# EAGLE board LEDS (EAGLE 8.0.1), part 1 of 2
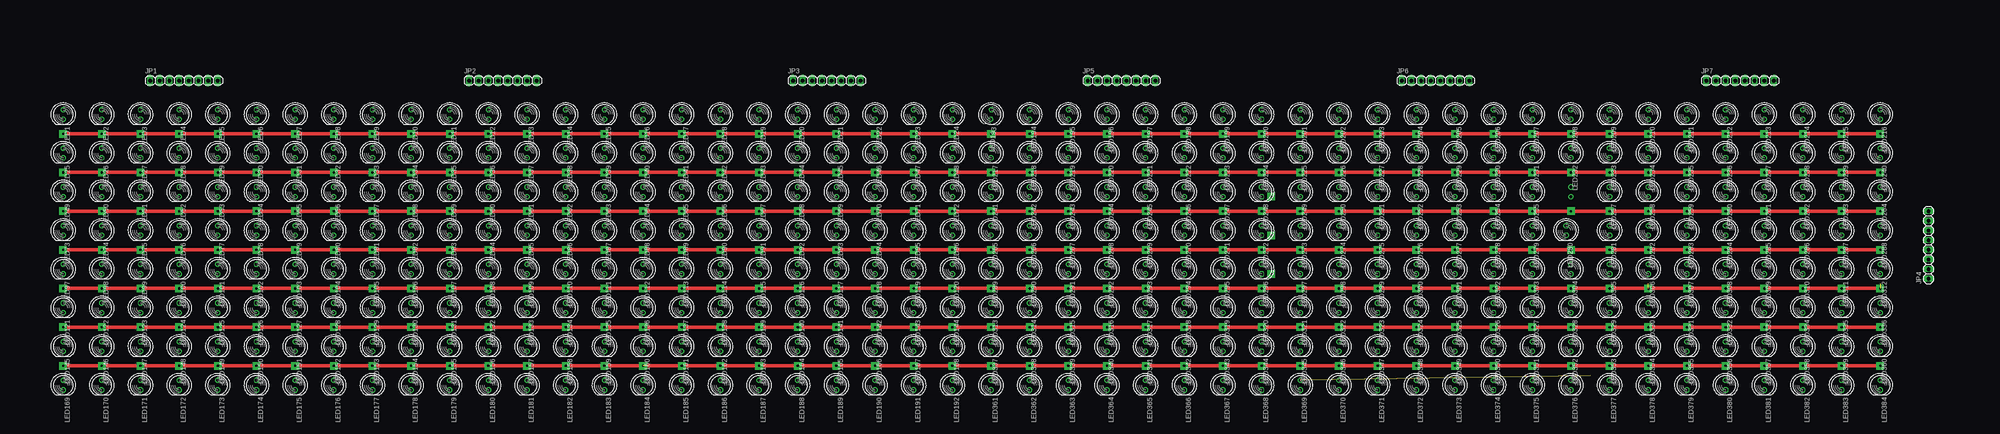
[diagram p1: board, top side]
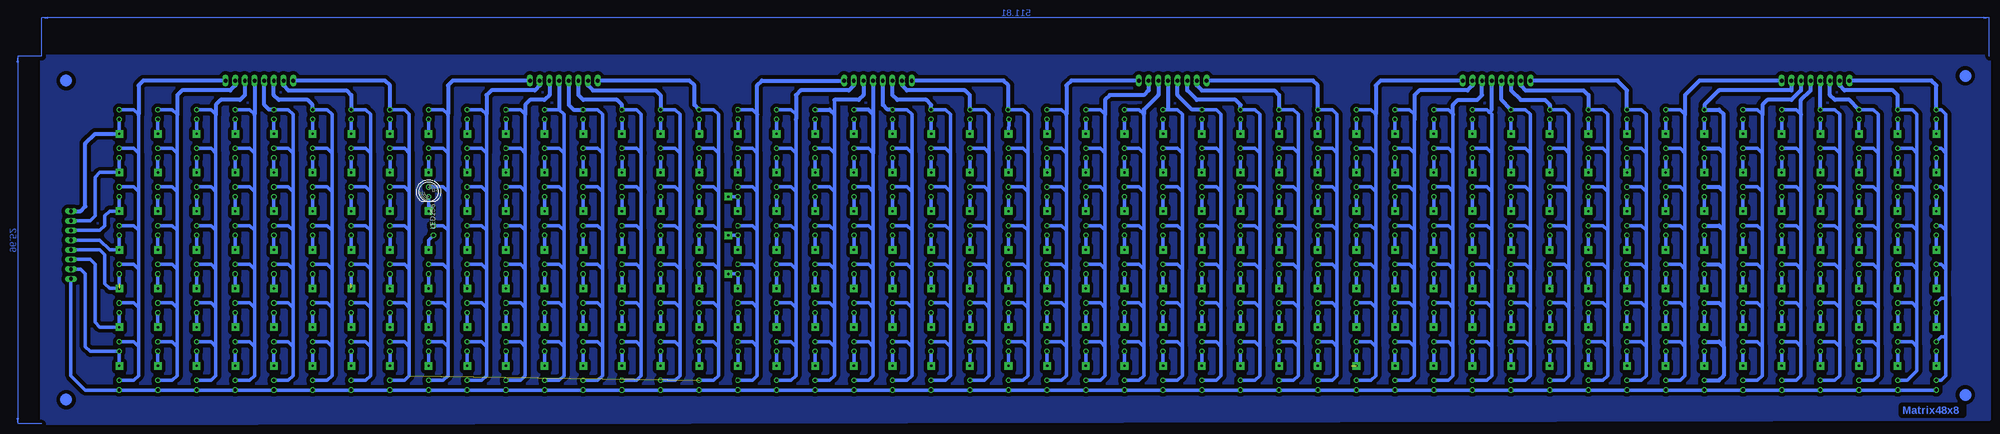
[diagram p2: board, bottom side, seen from below]

No outline drawn. Coordinates in mm, seen from the top.
Copper layers (1*16): Top 0.035mm / dielectric 1.5mm / Bottom 0.035mm
Design rules "default *": minimum track width 10mil, minimum drill 24mil, track to track 8mil, track to pad 8mil, pad to pad 8mil, via to via 8mil, smd to smd 8mil, copper to edge 40mil, drill to drill 8mil, minimum pad ring 10mil, minimum via ring 8mil, stop-mask expansion 4mil, vias tented up to drill 0mil, thermal gap 10mil

## Footprints (pad centres in the part's own frame; a part is rotated, then mirrored left to right if it is on the bottom)
1X08 = drill 1.016 long: 1 -8.89,0; 2 -6.35,0; 3 -3.81,0; 4 -1.27,0; 5 1.27,0; 6 3.81,0; 7 6.35,0; 8 8.89,0
LED5MM = drill 0.813 octagon: A -1.27,0; K 1.27,0

## Placement (x,y rotation side)
JP1  [1X08]  45.72,72.39 0 top
JP2  [1X08]  129.54,72.39 0 top
JP3  [1X08]  214.63,72.39 0 top
JP4  [1X08]  504.19,29.21 90 top
JP5  [1X08]  292.1,72.39 0 top
JP6  [1X08]  374.65,72.39 0 top
JP7  [1X08]  454.66,72.39 0 top
LED1  [LED5MM]  13.97,63.5 270 top
LED2  [LED5MM]  24.13,63.5 270 top
LED3  [LED5MM]  34.29,63.5 270 top
LED4  [LED5MM]  44.45,63.5 270 top
LED5  [LED5MM]  54.61,63.5 270 top
LED6  [LED5MM]  64.77,63.5 270 top
LED7  [LED5MM]  74.93,63.5 270 top
LED8  [LED5MM]  85.09,63.5 270 top
LED9  [LED5MM]  95.25,63.5 270 top
LED10  [LED5MM]  105.41,63.5 270 top
LED11  [LED5MM]  115.57,63.5 270 top
LED12  [LED5MM]  125.73,63.5 270 top
LED13  [LED5MM]  135.89,63.5 270 top
LED14  [LED5MM]  146.05,63.5 270 top
LED15  [LED5MM]  156.21,63.5 270 top
LED16  [LED5MM]  166.37,63.5 270 top
LED17  [LED5MM]  176.53,63.5 270 top
LED18  [LED5MM]  186.69,63.5 270 top
LED19  [LED5MM]  196.85,63.5 270 top
LED20  [LED5MM]  207.01,63.5 270 top
LED21  [LED5MM]  217.17,63.5 270 top
LED22  [LED5MM]  227.33,63.5 270 top
LED23  [LED5MM]  237.49,63.5 270 top
LED24  [LED5MM]  247.65,63.5 270 top
LED25  [LED5MM]  13.97,53.34 270 top
LED26  [LED5MM]  24.13,53.34 270 top
LED27  [LED5MM]  34.29,53.34 270 top
LED28  [LED5MM]  44.45,53.34 270 top
LED29  [LED5MM]  54.61,53.34 270 top
LED30  [LED5MM]  64.77,53.34 270 top
LED31  [LED5MM]  74.93,53.34 270 top
LED32  [LED5MM]  85.09,53.34 270 top
LED33  [LED5MM]  95.25,53.34 270 top
LED34  [LED5MM]  105.41,53.34 270 top
LED35  [LED5MM]  115.57,53.34 270 top
LED36  [LED5MM]  125.73,53.34 270 top
LED37  [LED5MM]  135.89,53.34 270 top
LED38  [LED5MM]  146.05,53.34 270 top
LED39  [LED5MM]  156.21,53.34 270 top
LED40  [LED5MM]  166.37,53.34 270 top
LED41  [LED5MM]  176.53,53.34 270 top
LED42  [LED5MM]  186.69,53.34 270 top
LED43  [LED5MM]  196.85,53.34 270 top
LED44  [LED5MM]  207.01,53.34 270 top
LED45  [LED5MM]  217.17,53.34 270 top
LED46  [LED5MM]  227.33,53.34 270 top
LED47  [LED5MM]  237.49,53.34 270 top
LED48  [LED5MM]  247.65,53.34 270 top
LED49  [LED5MM]  13.97,43.18 270 top
LED50  [LED5MM]  24.13,43.18 270 top
LED51  [LED5MM]  34.29,43.18 270 top
LED52  [LED5MM]  44.45,43.18 270 top
LED53  [LED5MM]  54.61,43.18 270 top
LED54  [LED5MM]  64.77,43.18 270 top
LED55  [LED5MM]  74.93,43.18 270 top
LED56  [LED5MM]  85.09,43.18 270 top
LED57  [LED5MM]  95.25,43.18 270 top
LED58  [LED5MM]  105.41,43.18 270 top
LED59  [LED5MM]  115.57,43.18 270 top
LED60  [LED5MM]  125.73,43.18 270 top
LED61  [LED5MM]  135.89,43.18 270 top
LED62  [LED5MM]  146.05,43.18 270 top
LED63  [LED5MM]  156.21,43.18 270 top
LED64  [LED5MM]  166.37,43.18 270 top
LED65  [LED5MM]  176.53,43.18 270 top
LED66  [LED5MM]  186.69,43.18 270 top
LED67  [LED5MM]  196.85,43.18 270 top
LED68  [LED5MM]  207.01,43.18 270 top
LED69  [LED5MM]  217.17,43.18 270 top
LED70  [LED5MM]  227.33,43.18 270 top
LED71  [LED5MM]  237.49,43.18 270 top
LED72  [LED5MM]  247.65,43.18 270 top
LED73  [LED5MM]  13.97,33.02 270 top
LED74  [LED5MM]  24.13,33.02 270 top
LED75  [LED5MM]  34.29,33.02 270 top
LED76  [LED5MM]  44.45,33.02 270 top
LED77  [LED5MM]  54.61,33.02 270 top
LED78  [LED5MM]  64.77,33.02 270 top
LED79  [LED5MM]  74.93,33.02 270 top
LED80  [LED5MM]  85.09,33.02 270 top
LED81  [LED5MM]  95.25,33.02 270 top
LED82  [LED5MM]  105.41,33.02 270 top
LED83  [LED5MM]  115.57,33.02 270 top
LED84  [LED5MM]  125.73,33.02 270 top
LED85  [LED5MM]  135.89,33.02 270 top
LED86  [LED5MM]  146.05,33.02 270 top
LED87  [LED5MM]  156.21,33.02 270 top
LED88  [LED5MM]  166.37,33.02 270 top
LED89  [LED5MM]  176.53,33.02 270 top
LED90  [LED5MM]  186.69,33.02 270 top
LED91  [LED5MM]  196.85,33.02 270 top
LED92  [LED5MM]  207.01,33.02 270 top
LED93  [LED5MM]  217.17,33.02 270 top
LED94  [LED5MM]  227.33,33.02 270 top
LED95  [LED5MM]  237.49,33.02 270 top
LED96  [LED5MM]  247.65,33.02 270 top
LED97  [LED5MM]  13.97,22.86 270 top
LED98  [LED5MM]  24.13,22.86 270 top
LED99  [LED5MM]  34.29,22.86 270 top
LED100  [LED5MM]  44.45,22.86 270 top
LED101  [LED5MM]  54.61,22.86 270 top
LED102  [LED5MM]  64.77,22.86 270 top
LED103  [LED5MM]  74.93,22.86 270 top
LED104  [LED5MM]  85.09,22.86 270 top
LED105  [LED5MM]  95.25,22.86 270 top
LED106  [LED5MM]  105.41,22.86 270 top
LED107  [LED5MM]  115.57,22.86 270 top
LED108  [LED5MM]  125.73,22.86 270 top
LED109  [LED5MM]  135.89,22.86 270 top
LED110  [LED5MM]  146.05,22.86 270 top
LED111  [LED5MM]  156.21,22.86 270 top
LED112  [LED5MM]  166.37,22.86 270 top
LED113  [LED5MM]  176.53,22.86 270 top
LED114  [LED5MM]  186.69,22.86 270 top
LED115  [LED5MM]  196.85,22.86 270 top
LED116  [LED5MM]  207.01,22.86 270 top
LED117  [LED5MM]  217.17,22.86 270 top
LED118  [LED5MM]  227.33,22.86 270 top
LED119  [LED5MM]  237.49,22.86 270 top
LED120  [LED5MM]  247.65,22.86 270 top
LED121  [LED5MM]  13.97,12.7 270 top
LED122  [LED5MM]  24.13,12.7 270 top
LED123  [LED5MM]  34.29,12.7 270 top
LED124  [LED5MM]  44.45,12.7 270 top
LED125  [LED5MM]  54.61,12.7 270 top
LED126  [LED5MM]  64.77,12.7 270 top
LED127  [LED5MM]  74.93,12.7 270 top
LED128  [LED5MM]  85.09,12.7 270 top
LED129  [LED5MM]  95.25,12.7 270 top
LED130  [LED5MM]  105.41,12.7 270 top
LED131  [LED5MM]  115.57,12.7 270 top
LED132  [LED5MM]  125.73,12.7 270 top
LED133  [LED5MM]  135.89,12.7 270 top
LED134  [LED5MM]  146.05,12.7 270 top
LED135  [LED5MM]  156.21,12.7 270 top
LED136  [LED5MM]  166.37,12.7 270 top
LED137  [LED5MM]  176.53,12.7 270 top
LED138  [LED5MM]  186.69,12.7 270 top
LED139  [LED5MM]  196.85,12.7 270 top
LED140  [LED5MM]  207.01,12.7 270 top
LED141  [LED5MM]  217.17,12.7 270 top
LED142  [LED5MM]  227.33,12.7 270 top
LED143  [LED5MM]  237.49,12.7 270 top
LED144  [LED5MM]  247.65,12.7 270 top
LED145  [LED5MM]  13.97,2.54 270 top
LED146  [LED5MM]  24.13,2.54 270 top
LED147  [LED5MM]  34.29,2.54 270 top
LED148  [LED5MM]  44.45,2.54 270 top
LED149  [LED5MM]  54.61,2.54 270 top
LED150  [LED5MM]  64.77,2.54 270 top
LED151  [LED5MM]  74.93,2.54 270 top
LED152  [LED5MM]  85.09,2.54 270 top
LED153  [LED5MM]  95.25,2.54 270 top
LED154  [LED5MM]  105.41,2.54 270 top
LED155  [LED5MM]  115.57,2.54 270 top
LED156  [LED5MM]  125.73,2.54 270 top
LED157  [LED5MM]  135.89,2.54 270 top
LED158  [LED5MM]  146.05,2.54 270 top
LED159  [LED5MM]  156.21,2.54 270 top
LED160  [LED5MM]  166.37,2.54 270 top
LED161  [LED5MM]  176.53,2.54 270 top
LED162  [LED5MM]  186.69,2.54 270 top
LED163  [LED5MM]  196.85,2.54 270 top
LED164  [LED5MM]  207.01,2.54 270 top
LED165  [LED5MM]  217.17,2.54 270 top
LED166  [LED5MM]  227.33,2.54 270 top
LED167  [LED5MM]  237.49,2.54 270 top
LED168  [LED5MM]  247.65,2.54 270 top
LED169  [LED5MM]  13.97,-7.62 270 top
LED170  [LED5MM]  24.13,-7.62 270 top
LED171  [LED5MM]  34.29,-7.62 270 top
LED172  [LED5MM]  44.45,-7.62 270 top
LED173  [LED5MM]  54.61,-7.62 270 top
LED174  [LED5MM]  64.77,-7.62 270 top
LED175  [LED5MM]  74.93,-7.62 270 top
LED176  [LED5MM]  85.09,-7.62 270 top
LED177  [LED5MM]  95.25,-7.62 270 top
LED178  [LED5MM]  105.41,-7.62 270 top
LED179  [LED5MM]  115.57,-7.62 270 top
LED180  [LED5MM]  125.73,-7.62 270 top
LED181  [LED5MM]  135.89,-7.62 270 top
LED182  [LED5MM]  146.05,-7.62 270 top
LED183  [LED5MM]  156.21,-7.62 270 top
LED184  [LED5MM]  166.37,-7.62 270 top
LED185  [LED5MM]  176.53,-7.62 270 top
LED186  [LED5MM]  186.69,-7.62 270 top
LED187  [LED5MM]  196.85,-7.62 270 top
LED188  [LED5MM]  207.01,-7.62 270 top
LED189  [LED5MM]  217.17,-7.62 270 top
LED190  [LED5MM]  227.33,-7.62 270 top
LED191  [LED5MM]  237.49,-7.62 270 top
LED192  [LED5MM]  247.65,-7.62 270 top
LED193  [LED5MM]  257.81,63.5 264.8 top
LED194  [LED5MM]  267.97,63.5 270 top
LED195  [LED5MM]  278.13,63.5 270 top
LED196  [LED5MM]  288.29,63.5 270 top
LED197  [LED5MM]  298.45,63.5 270 top
LED198  [LED5MM]  308.61,63.5 270 top
LED199  [LED5MM]  318.77,63.5 270 top
LED200  [LED5MM]  328.93,63.5 270 top
LED201  [LED5MM]  339.09,63.5 270 top
LED202  [LED5MM]  349.25,63.5 270 top
LED203  [LED5MM]  359.41,63.5 270 top
LED204  [LED5MM]  369.57,63.5 270 top
LED205  [LED5MM]  379.73,63.5 270 top
LED206  [LED5MM]  389.89,63.5 270 top
LED207  [LED5MM]  400.05,63.5 270 top
LED208  [LED5MM]  410.21,63.5 270 top
LED209  [LED5MM]  420.37,63.5 270 top
LED210  [LED5MM]  430.53,63.5 270 top
LED211  [LED5MM]  440.69,63.5 270 top
LED212  [LED5MM]  450.85,63.5 270 top
LED213  [LED5MM]  461.01,63.5 270 top
LED214  [LED5MM]  471.17,63.5 270 top
LED215  [LED5MM]  481.33,63.5 270 top
LED216  [LED5MM]  491.49,63.5 270 top
LED217  [LED5MM]  257.81,53.34 270 top
LED218  [LED5MM]  267.97,53.34 270 top
LED219  [LED5MM]  278.13,53.34 270 top
LED220  [LED5MM]  288.29,53.34 270 top
LED221  [LED5MM]  298.45,53.34 270 top
LED222  [LED5MM]  308.61,53.34 270 top
LED223  [LED5MM]  318.77,53.34 270 top
LED224  [LED5MM]  328.93,53.34 270 top
LED225  [LED5MM]  339.09,53.34 270 top
LED226  [LED5MM]  349.25,53.34 270 top
LED227  [LED5MM]  359.41,53.34 270 top
LED228  [LED5MM]  369.57,53.34 270 top
LED229  [LED5MM]  379.73,53.34 270 top
LED230  [LED5MM]  389.89,53.34 270 top
LED231  [LED5MM]  400.05,53.34 270 top
LED232  [LED5MM]  410.21,53.34 270 top
LED233  [LED5MM]  420.37,53.34 270 top
LED234  [LED5MM]  430.53,53.34 270 top
LED235  [LED5MM]  440.69,53.34 270 top
LED236  [LED5MM]  450.85,53.34 270 top
LED237  [LED5MM]  461.01,53.34 270 top
LED238  [LED5MM]  471.17,53.34 270 top
LED239  [LED5MM]  481.33,53.34 270 top
LED240  [LED5MM]  491.49,53.34 270 top
LED241  [LED5MM]  257.81,43.18 270 top
LED242  [LED5MM]  267.97,43.18 270 top
LED243  [LED5MM]  278.13,43.18 270 top
LED244  [LED5MM]  288.29,43.18 270 top
LED245  [LED5MM]  298.45,43.18 270 top
LED246  [LED5MM]  308.61,43.18 270 top
LED247  [LED5MM]  318.77,43.18 270 top
LED248  [LED5MM]  328.93,43.18 270 top
LED249  [LED5MM]  339.09,43.18 270 top
LED250  [LED5MM]  349.25,43.18 270 top
LED251  [LED5MM]  359.41,43.18 270 top
LED252  [LED5MM]  369.57,43.18 270 top
LED253  [LED5MM]  379.73,43.18 270 top
LED254  [LED5MM]  389.89,43.18 270 top
LED255  [LED5MM]  400.05,43.18 270 top
LED256  [LED5MM]  410.21,43.18 270 bottom
LED257  [LED5MM]  420.37,43.18 270 top
LED258  [LED5MM]  430.53,43.18 270 top
LED259  [LED5MM]  440.69,43.18 270 top
LED260  [LED5MM]  450.85,43.18 270 top
LED261  [LED5MM]  461.01,43.18 270 top
LED262  [LED5MM]  471.17,43.18 270 top
LED263  [LED5MM]  481.33,43.18 270 top
LED264  [LED5MM]  491.49,43.18 270 top
LED265  [LED5MM]  257.81,33.02 270 top
LED266  [LED5MM]  267.97,33.02 270 top
LED267  [LED5MM]  278.13,33.02 270 top
LED268  [LED5MM]  288.29,33.02 270 top
LED269  [LED5MM]  298.45,33.02 270 top
LED270  [LED5MM]  308.61,33.02 270 top
LED271  [LED5MM]  318.77,33.02 270 top
LED272  [LED5MM]  328.93,33.02 270 top
LED273  [LED5MM]  339.09,33.02 270 top
LED274  [LED5MM]  349.25,33.02 270 top
LED275  [LED5MM]  359.41,33.02 270 top
LED276  [LED5MM]  369.57,33.02 270 top
LED277  [LED5MM]  379.73,33.02 270 top
LED278  [LED5MM]  389.89,33.02 270 top
LED279  [LED5MM]  400.05,33.02 270 top
LED280  [LED5MM]  408.94,33.02 270 top
LED281  [LED5MM]  420.37,33.02 270 top
LED282  [LED5MM]  430.53,33.02 270 top
LED283  [LED5MM]  440.69,33.02 270 top
LED284  [LED5MM]  450.85,33.02 270 top
LED285  [LED5MM]  461.01,33.02 270 top
LED286  [LED5MM]  471.17,33.02 270 top
LED287  [LED5MM]  481.33,33.02 270 top
LED288  [LED5MM]  491.49,33.02 270 top
LED289  [LED5MM]  257.81,22.86 270 top
LED290  [LED5MM]  267.97,22.86 270 top
LED291  [LED5MM]  278.13,22.86 270 top
LED292  [LED5MM]  288.29,22.86 270 top
LED293  [LED5MM]  298.45,22.86 270 top
LED294  [LED5MM]  308.61,22.86 270 top
LED295  [LED5MM]  318.77,22.86 270 top
LED296  [LED5MM]  328.93,22.86 270 top
LED297  [LED5MM]  339.09,22.86 270 top
LED298  [LED5MM]  349.25,22.86 270 top
LED299  [LED5MM]  359.41,22.86 270 top
LED300  [LED5MM]  369.57,22.86 270 top
LED301  [LED5MM]  379.73,22.86 270 top
LED302  [LED5MM]  389.89,22.86 270 top
LED303  [LED5MM]  400.05,22.86 270 top
LED304  [LED5MM]  410.21,22.86 270 top
LED305  [LED5MM]  420.37,22.86 270 top
LED306  [LED5MM]  430.53,22.86 270 top
LED307  [LED5MM]  440.69,22.86 270 top
LED308  [LED5MM]  450.85,22.86 270 top
LED309  [LED5MM]  461.01,22.86 270 top
LED310  [LED5MM]  471.17,22.86 270 top
LED311  [LED5MM]  481.33,22.86 270 top
LED312  [LED5MM]  491.49,22.86 270 top
LED313  [LED5MM]  257.81,12.7 270 top
LED314  [LED5MM]  267.97,12.7 270 top
LED315  [LED5MM]  278.13,12.7 270 top
LED316  [LED5MM]  288.29,12.7 270 top
LED317  [LED5MM]  298.45,12.7 270 top
LED318  [LED5MM]  308.61,12.7 270 top
LED319  [LED5MM]  318.77,12.7 270 top
LED320  [LED5MM]  328.93,12.7 270 top
LED321  [LED5MM]  339.09,12.7 270 top
LED322  [LED5MM]  349.25,12.7 270 top
LED323  [LED5MM]  359.41,12.7 270 top
LED324  [LED5MM]  369.57,12.7 270 top
LED325  [LED5MM]  379.73,12.7 270 top
LED326  [LED5MM]  389.89,12.7 270 top
LED327  [LED5MM]  400.05,12.7 270 top
LED328  [LED5MM]  410.21,12.7 270 top
LED329  [LED5MM]  420.37,12.7 270 top
LED330  [LED5MM]  430.53,12.7 270 top
LED331  [LED5MM]  440.69,12.7 270 top
LED332  [LED5MM]  450.85,12.7 270 top
LED333  [LED5MM]  461.01,12.7 270 top
LED334  [LED5MM]  471.17,12.7 270 top
LED335  [LED5MM]  481.33,12.7 270 top
LED336  [LED5MM]  491.49,12.7 270 top
LED337  [LED5MM]  257.81,2.54 270 top
LED338  [LED5MM]  267.97,2.54 270 top
LED339  [LED5MM]  278.13,2.54 270 top
LED340  [LED5MM]  288.29,2.54 270 top
LED341  [LED5MM]  298.45,2.54 270 top
LED342  [LED5MM]  308.61,2.54 270 top
LED343  [LED5MM]  318.77,2.54 270 top
LED344  [LED5MM]  328.93,2.54 270 top
LED345  [LED5MM]  339.09,2.54 270 top
LED346  [LED5MM]  349.25,2.54 270 top
LED347  [LED5MM]  359.41,2.54 270 top
LED348  [LED5MM]  369.57,2.54 270 top
LED349  [LED5MM]  379.73,2.54 270 top
LED350  [LED5MM]  389.89,2.54 270 top
LED351  [LED5MM]  400.05,2.54 270 top
LED352  [LED5MM]  410.21,2.54 270 top
LED353  [LED5MM]  420.37,2.54 270 top
LED354  [LED5MM]  430.53,2.54 270 top
LED355  [LED5MM]  440.69,2.54 270 top
LED356  [LED5MM]  450.85,2.54 270 top
LED357  [LED5MM]  461.01,2.54 270 top
LED358  [LED5MM]  471.17,2.54 270 top
LED359  [LED5MM]  481.33,2.54 270 top
LED360  [LED5MM]  491.49,2.54 270 top
LED361  [LED5MM]  257.81,-7.62 270 top
LED362  [LED5MM]  267.97,-7.62 270 top
LED363  [LED5MM]  278.13,-7.62 270 top
LED364  [LED5MM]  288.29,-7.62 270 top
LED365  [LED5MM]  298.45,-7.62 270 top
LED366  [LED5MM]  308.61,-7.62 270 top
LED367  [LED5MM]  318.77,-7.62 270 top
LED368  [LED5MM]  328.93,-7.62 270 top
LED369  [LED5MM]  339.09,-7.62 270 top
LED370  [LED5MM]  349.25,-7.62 270 top
LED371  [LED5MM]  359.41,-7.62 270 top
LED372  [LED5MM]  369.57,-7.62 270 top
LED373  [LED5MM]  379.73,-7.62 270 top
LED374  [LED5MM]  389.89,-7.62 270 top
LED375  [LED5MM]  400.05,-7.62 270 top
LED376  [LED5MM]  410.21,-7.62 270 top
LED377  [LED5MM]  420.37,-7.62 270 top
LED378  [LED5MM]  430.53,-7.62 270 top
LED379  [LED5MM]  440.69,-7.62 270 top
LED380  [LED5MM]  450.85,-7.62 270 top
LED381  [LED5MM]  461.01,-7.62 270 top
LED382  [LED5MM]  471.17,-7.62 270 top
LED383  [LED5MM]  481.33,-7.62 270 top
LED384  [LED5MM]  491.49,-7.62 270 top